# EasyEDA Pro project PCB-WearableGasDetect.epro, board PCB4
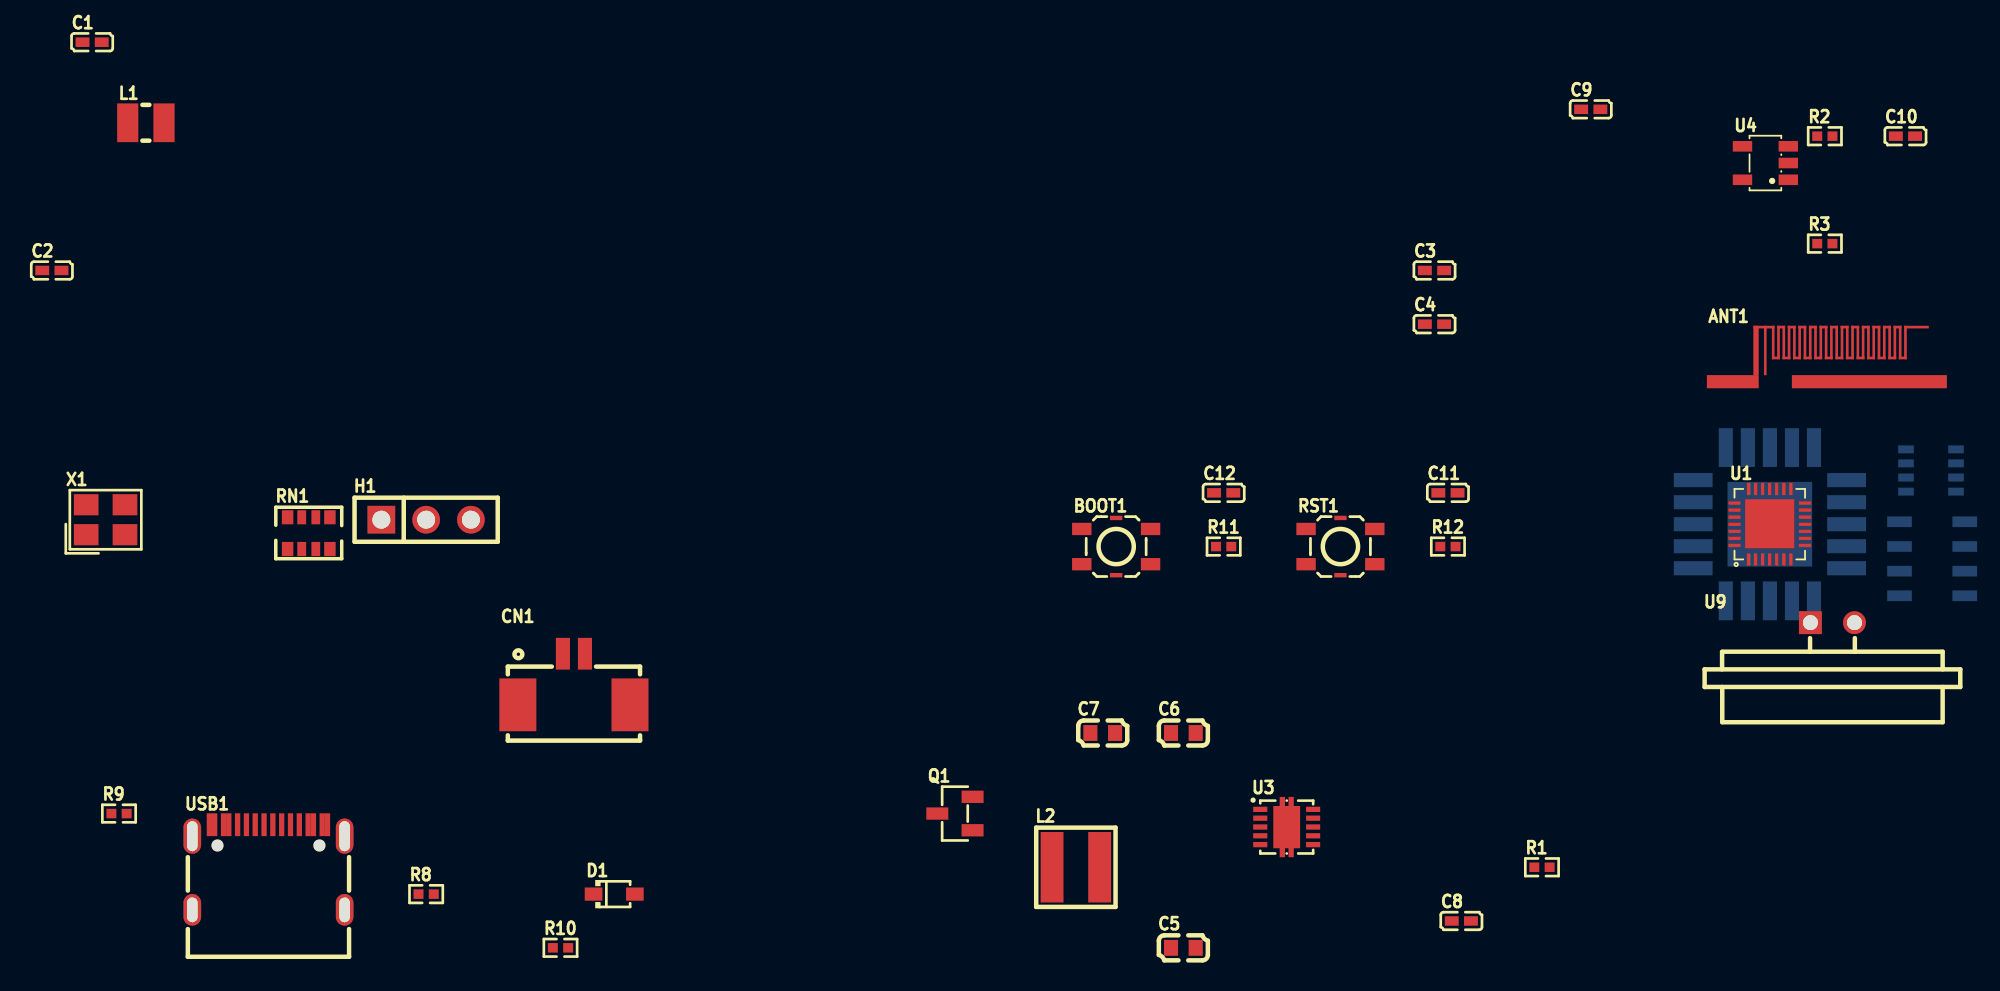
[diagram p6: board, top side]
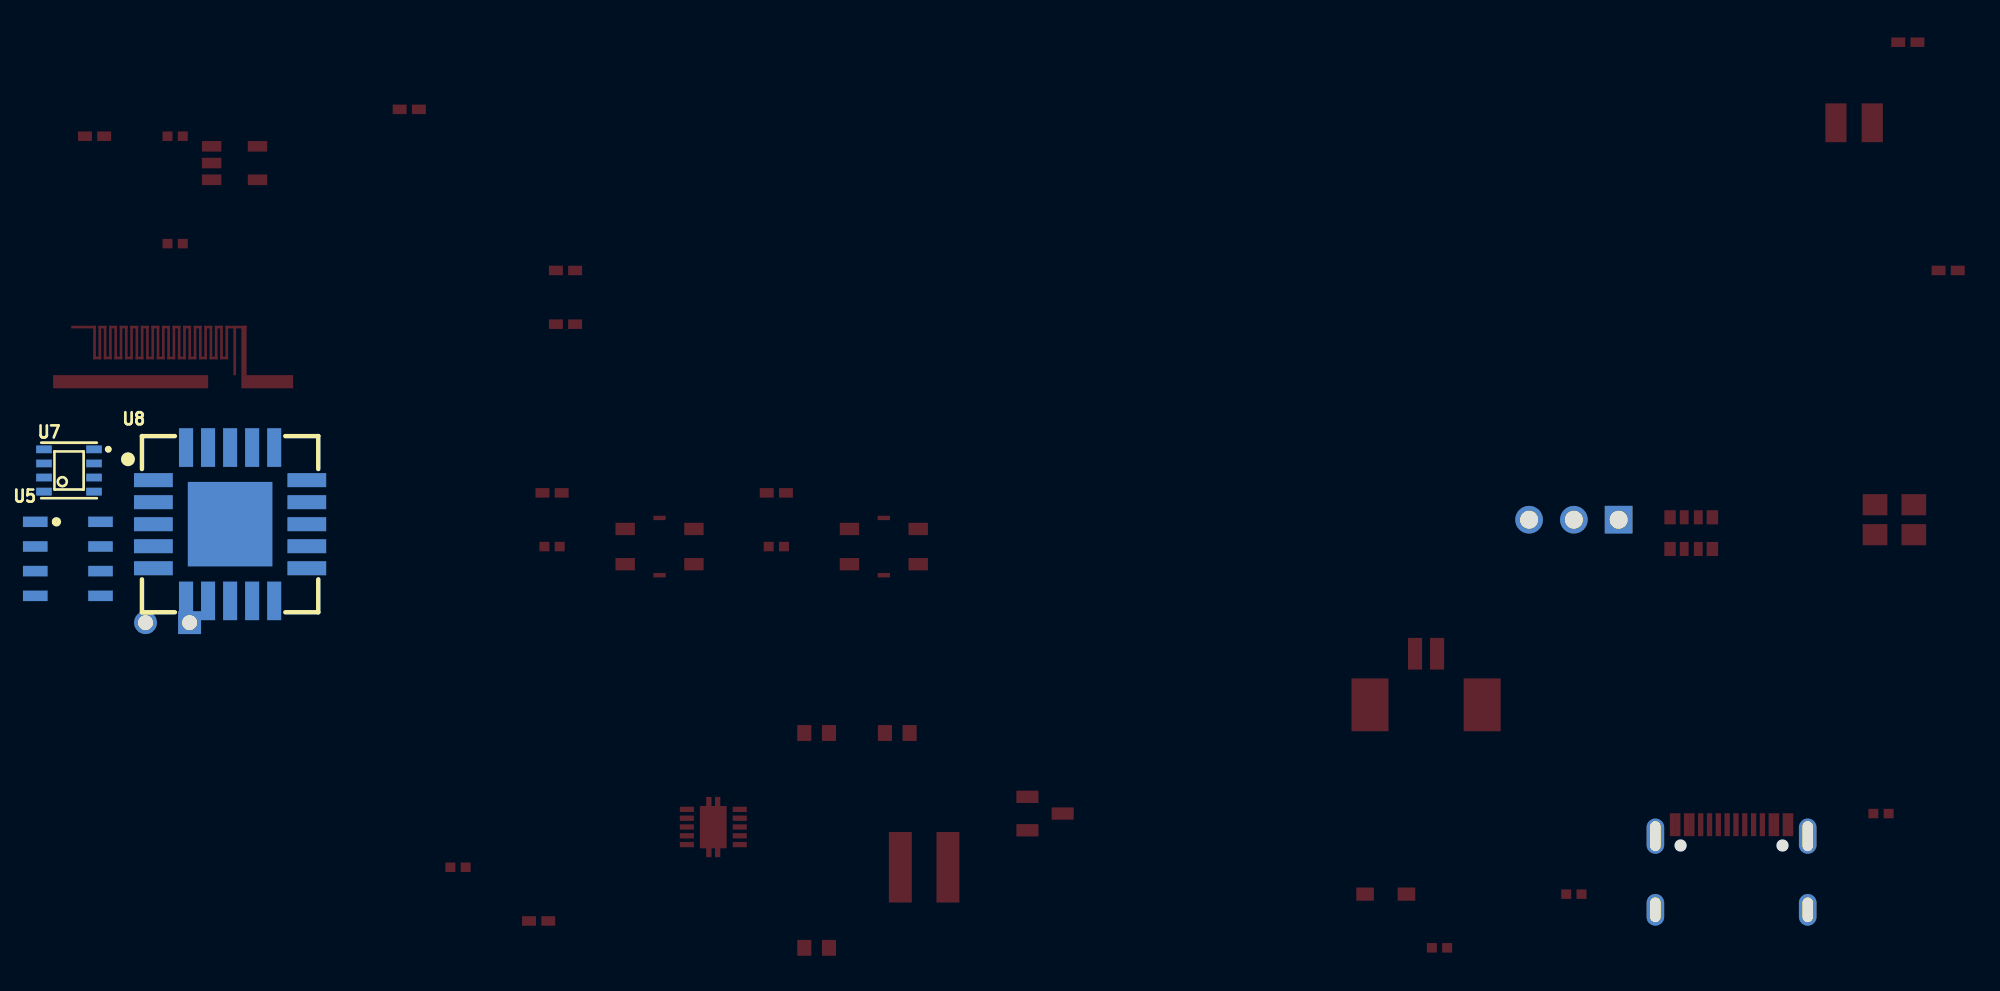
[diagram p7: board, bottom side, seen from below]

Outline 6.47 x 0.69 mm; copper layers: Top Layer, Inner1, Inner2, Inner3, Inner4, Bottom Layer. Coordinates in mm from the lower left corner of the outline.
Stack: Top Layer 0.035mm 外层铜厚1oz / Dielectric1 0.0994mm 3313 RC57% 4.2mil / Inner1 0.0152mm 内层铜厚 / Dielectric2 0.55mm 0.55mm H/H不含铜 / Inner2 0.0152mm 内层铜厚 / Dielectric3 0.1088mm 2116 RC54% 4.9mil / Inner3 0.0152mm 内层铜厚 / Dielectric4 0.55mm 0.55mm H/H不含铜 / Inner4 0.0152mm 内层铜厚 / Dielectric5 0.0994mm 3313 RC57% 4.2mil / Bottom Layer 0.035mm 外层铜厚1oz

## Design rules (mm)
template: JLCPCB Capability(Two Layers Board)
spacing copperThickness1oz (default): track to track 0.102, other pairs 0.152 to 0.3
spacing copperThickness2oz: track to track 0.203, other pairs 0.152 to 0.3
track width copperThickness1oz (default): min 0.127, default 0.254, max 2.54
track width copperThickness2oz: min 0.203, default 0.254, max 2.54
differential pair differentialPair (default): width min 0.127, default 0.254, max 2.54; gap min 0.152, default 0.152
via viaSize (default): diameter min 0.5, default 0.61, max 10; hole min 0.3, default 0.305, max 6.3

## Placement (name value [footprint] x y rotation side)
ANT1  -  [ANT-F-1-2.4G-0.8MMFR4-WCH]  88.13 27.09 0 top
BOOT1  YTS-A007-1C  [SW-SMD_6P-L3.4-W3.4-P2.00-LS4.0]  51.32 17.31 0 top
C1  2.2uF  [C0402]  -6.76 45.93 0 top
C2  2.2uF  [C0402]  -9.05 32.98 0 top
C3  100nF  [C0402]  69.37 32.98 0 top
C4  1uF  [C0402]  69.37 29.93 0 top
C5  10uF  [C0603]  55.13 -5.46 0 top
C6  10uF  [C0603]  55.13 6.73 0 top
C7  10uF  [C0603]  50.55 6.73 0 top
C8  100nF  [C0402]  70.89 -3.94 0 top
C9  1uF  [C0402]  78.23 42.12 0 top
C10  1uF  [C0402]  96.08 40.6 0 top
C11  100nF  [C0402]  70.13 20.36 0 top
C12  100nF  [C0402]  57.41 20.36 0 top
CN1  HX 1.25-2P WT  [CONN-SMD_2P-P1.25_HX1.25-2PWT]  20.56 9.78 0 top
D1  1N5819WS  [SOD-323_L1.8-W1.3-LS2.5-RD]  22.85 -2.41 0 top
H1  -  [HDR-TH_3P-P2.54-V-F]  12.18 18.84 0 top
L1  10uH  [IND-SMD_L2.5-W2.0]  -3.71 41.36 0 top
L2  2.2uH  [IND-SMD_L4.0-W4.0_VLS4012ET]  49.03 -0.89 0 top
Q1  SI2301DS  [SOT-23-3_L2.9-W1.3-P1.90-LS2.4-BR]  42.17 2.16 0 top
R1  100  [R0402]  75.46 -0.89 0 top
R2  8K  [R0402]  91.51 40.6 0 top
R3  50K  [R0402]  91.51 34.5 0 top
R8  5.1k  [R0402]  12.18 -2.41 0 top
R9  5.1k  [R0402]  -5.24 2.16 0 top
R10  100K  [R0402]  19.8 -5.46 0 top
R11  10K  [R0402]  57.41 17.31 0 top
R12  10K  [R0402]  70.13 17.31 0 top
RN1  10kΩ  [RES-ARRAY-SMD_0603-8P-L3.2-W1.6-BL]  5.52 18.07 0 top
RST1  YTS-A007-1C  [SW-SMD_6P-L3.4-W3.4-P2.00-LS4.0]  64.03 17.31 0 top
U1  CH582F  [QFN-28_L4.0-W4.0-P0.40-BL-EP2.8]  88.38 18.58 0 top
U3  TPS63001DRCT  [VSON-10_L3.0-W3.0-P0.50-TL-EP]  60.99 1.4 0 top
U4  SGM2019-ADJYN5G/TR  [SOT-23-5_L3.0-W1.7-P0.95-LS2.8-BR]  88.14 39.08 0 top
U5  -  [JED8101]  95.24 14.52 180 bottom
U7  BME688  [LGA-8_L3.0-W3.0-P0.80_BME688]  97.53 21.63 180 bottom
U8  SCD40-D-R1  [LGA-20_L10.1-W10.1-P1.25-TL]  88.39 18.58 180 bottom
U9  PR5W4036-2P-C-F  [CONN-TH_PR5W4036-2P-C-F]  91.94 12.99 0 top
USB1  KH-TYPE-C-16P  [USB-C-SMD_KH-TYPE-C-16P]  3.24 -0.89 0 top
X1  32MHz  [CRYSTAL-SMD_4P-L3.2-W2.5-BL]  -6 18.84 0 top

## Footprints (pads in the part's own frame, mm; a bottom-side part is the same pattern mirrored in y, then rotated)
ANT-F-1-2.4G-0.8MMFR4-WCH
  rect 0.1x0.1 smd: 0(-0.525,0) 1(0,0)
C0402
  rect 0.79x0.54 smd: 1(-0.545,0) 2(0.545,0)
C0603
  rect 0.8x0.9 smd: 1(-0.7,0) 2(0.7,0)
CONN-SMD_2P-P1.25_HX1.25-2PWT
  rect 0.8x1.8 smd: 1(-0.625,1.45) 2(0.625,1.45)
  rect 2.1x3 smd: 3(-3.18,-1.45) 4(3.18,-1.45)
CONN-TH_PR5W4036-2P-C-F
  rect 1.3x1.3 hole 0.85: 1(-1.25,0)
  round 1.3 hole 0.85: 2(1.25,0)
CRYSTAL-SMD_4P-L3.2-W2.5-BL
  rect 1.4x1.2 smd: 1(-1.1,-0.85) 2(1.1,-0.85) 3(1.1,0.85) 4(-1.1,0.85)
HDR-TH_3P-P2.54-V-F
  rect 1.575x1.575 hole 1.02: 1(-2.54,0)
  round 1.575 hole 1.02: 2(0,0) 3(2.54,0)
IND-SMD_L2.5-W2.0
  rect 1.2x2.2 smd: 1(1.028,0) 2(-1.028,0)
IND-SMD_L4.0-W4.0_VLS4012ET
  rect 1.3x4 smd: 1(-1.35,0) 2(1.35,0)
JED8101
  custom 1.4x0.6 smd: 1(-4.2,4.2) 2(-4.2,2.8) 3(-4.2,1.4) 4(-4.2,0) 5(-0.5,0) 6(-0.5,1.4) 7(-0.5,2.8) 8(-0.5,4.2)
LGA-8_L3.0-W3.0-P0.80_BME688
  rect 0.889x0.448 smd: 1(1.419,1.2) 2(1.419,0.4) 3(1.419,-0.4) 4(1.419,-1.2) 5(-1.419,-1.2) 6(-1.419,-0.4) 7(-1.419,0.4) 8(-1.419,1.2)
LGA-20_L10.1-W10.1-P1.25-TL
  rect 2.2x0.8 smd: 1(-4.35,2.5) 2(-4.35,1.25) 3(-4.35,0) 4(-4.35,-1.25) 5(-4.35,-2.5) 11(4.35,-2.5) 12(4.35,-1.25) 13(4.35,0) 14(4.35,1.25) 15(4.35,2.5)
  rect 0.8x2.2 smd: 6(-2.5,-4.35) 7(-1.25,-4.35) 8(0,-4.35) 9(1.25,-4.35) 10(2.5,-4.35) 16(2.5,4.35) 17(1.25,4.35) 18(0,4.35) 19(-1.25,4.35) 20(-2.5,4.35)
  rect 4.8x4.8 smd: 21(0,0)
QFN-28_L4.0-W4.0-P0.40-BL-EP2.8
  rect 0.2x0.7 smd: 1(-1.2,-2) 2(-0.8,-2) 3(-0.4,-2) 4(-0.001,-2) 5(0.4,-2) 6(0.8,-2) 7(1.2,-2) 15(1.2,2) 16(0.8,2) 17(0.4,2) 18(0,2) 19(-0.4,2) 20(-0.8,2) 21(-1.2,2)
  rect 0.7x0.2 smd: 8(2,-1.2) 9(2,-0.8) 10(2,-0.4) 11(1.999,0) 12(2,0.4) 13(2,0.8) 14(2,1.2) 22(-2,1.2) 23(-2,0.8) 24(-2,0.4) 25(-2,0) 26(-2,-0.4) 27(-2,-0.8) 28(-2,-1.2)
  rect 2.8x2.8 smd: 29(0.001,0.02)
R0402
  rect 0.566x0.54 smd: 1(-0.433,0) 2(0.433,0)
RES-ARRAY-SMD_0603-8P-L3.2-W1.6-BL
  rect 0.65x0.8 smd: 1(-1.2,-0.9) 4(1.2,-0.9) 5(1.2,0.9) 8(-1.2,0.9)
  rect 0.5x0.8 smd: 2(-0.4,-0.9) 3(0.4,-0.9) 6(0.4,0.9) 7(-0.4,0.9)
SOD-323_L1.8-W1.3-LS2.5-RD
  rect 1x0.75 smd: 1(-1.173,0) 2(1.173,0)
SOT-23-3_L2.9-W1.3-P1.90-LS2.4-BR
  rect 1.25x0.7 smd: 1(1,-0.95) 2(1,0.95) 3(-1,0)
SOT-23-5_L3.0-W1.7-P0.95-LS2.8-BR
  rect 1.1x0.6 smd: 1(1.3,-0.95) 2(1.3,0) 3(1.3,0.95) 4(-1.3,0.95) 5(-1.3,-0.95)
SW-SMD_6P-L3.4-W3.4-P2.00-LS4.0
  rect 1.1x0.7 smd: 1(-1.95,1) 2(1.95,1) 3(-1.95,-1) 4(1.95,-1)
  rect 0.7x0.25 smd: 5(0,1.625) 6(0,-1.625)
USB-C-SMD_KH-TYPE-C-16P
  oval 1x2 hole 0.6x1.7: 1(-4.32,1.765) 2(4.32,1.765)
  oval 1x1.8 hole 0.6x1.4: 3(-4.32,-2.415) 4(4.32,-2.415)
  rect 0.3x1.3 smd: A1(-3.35,2.415) A4(-2.55,2.415) A5(-1.25,2.415) A6(-0.25,2.415) A7(0.25,2.415) A8(1.25,2.415) A9(2.55,2.415) A12(3.35,2.415) B1(3.05,2.415) B4(2.25,2.415) B5(1.75,2.415) B6(0.75,2.415) B7(-0.75,2.415) B8(-1.75,2.415) B9(-2.25,2.415) B12(-3.05,2.415)
VSON-10_L3.0-W3.0-P0.50-TL-EP
  rect 0.8x0.3 smd: 1(-1.5,1) 2(-1.5,0.5) 3(-1.5,0) 4(-1.5,-0.5) 5(-1.5,-1) 6(1.5,-1) 7(1.5,-0.5) 8(1.5,0) 9(1.5,0.5) 10(1.5,1)
  custom 1.52x3.42 smd: 11(0.002,-0.009)

## Nets
As in the schematic.

Pads without a net: U1 1 2 15 23 24 25 26 27 28; U5 2 5 6; U8 1 2 3 4 5 8 11 12 13 14 15 16 17 18
